# EAGLE design triac-1 (EAGLE 4.15)
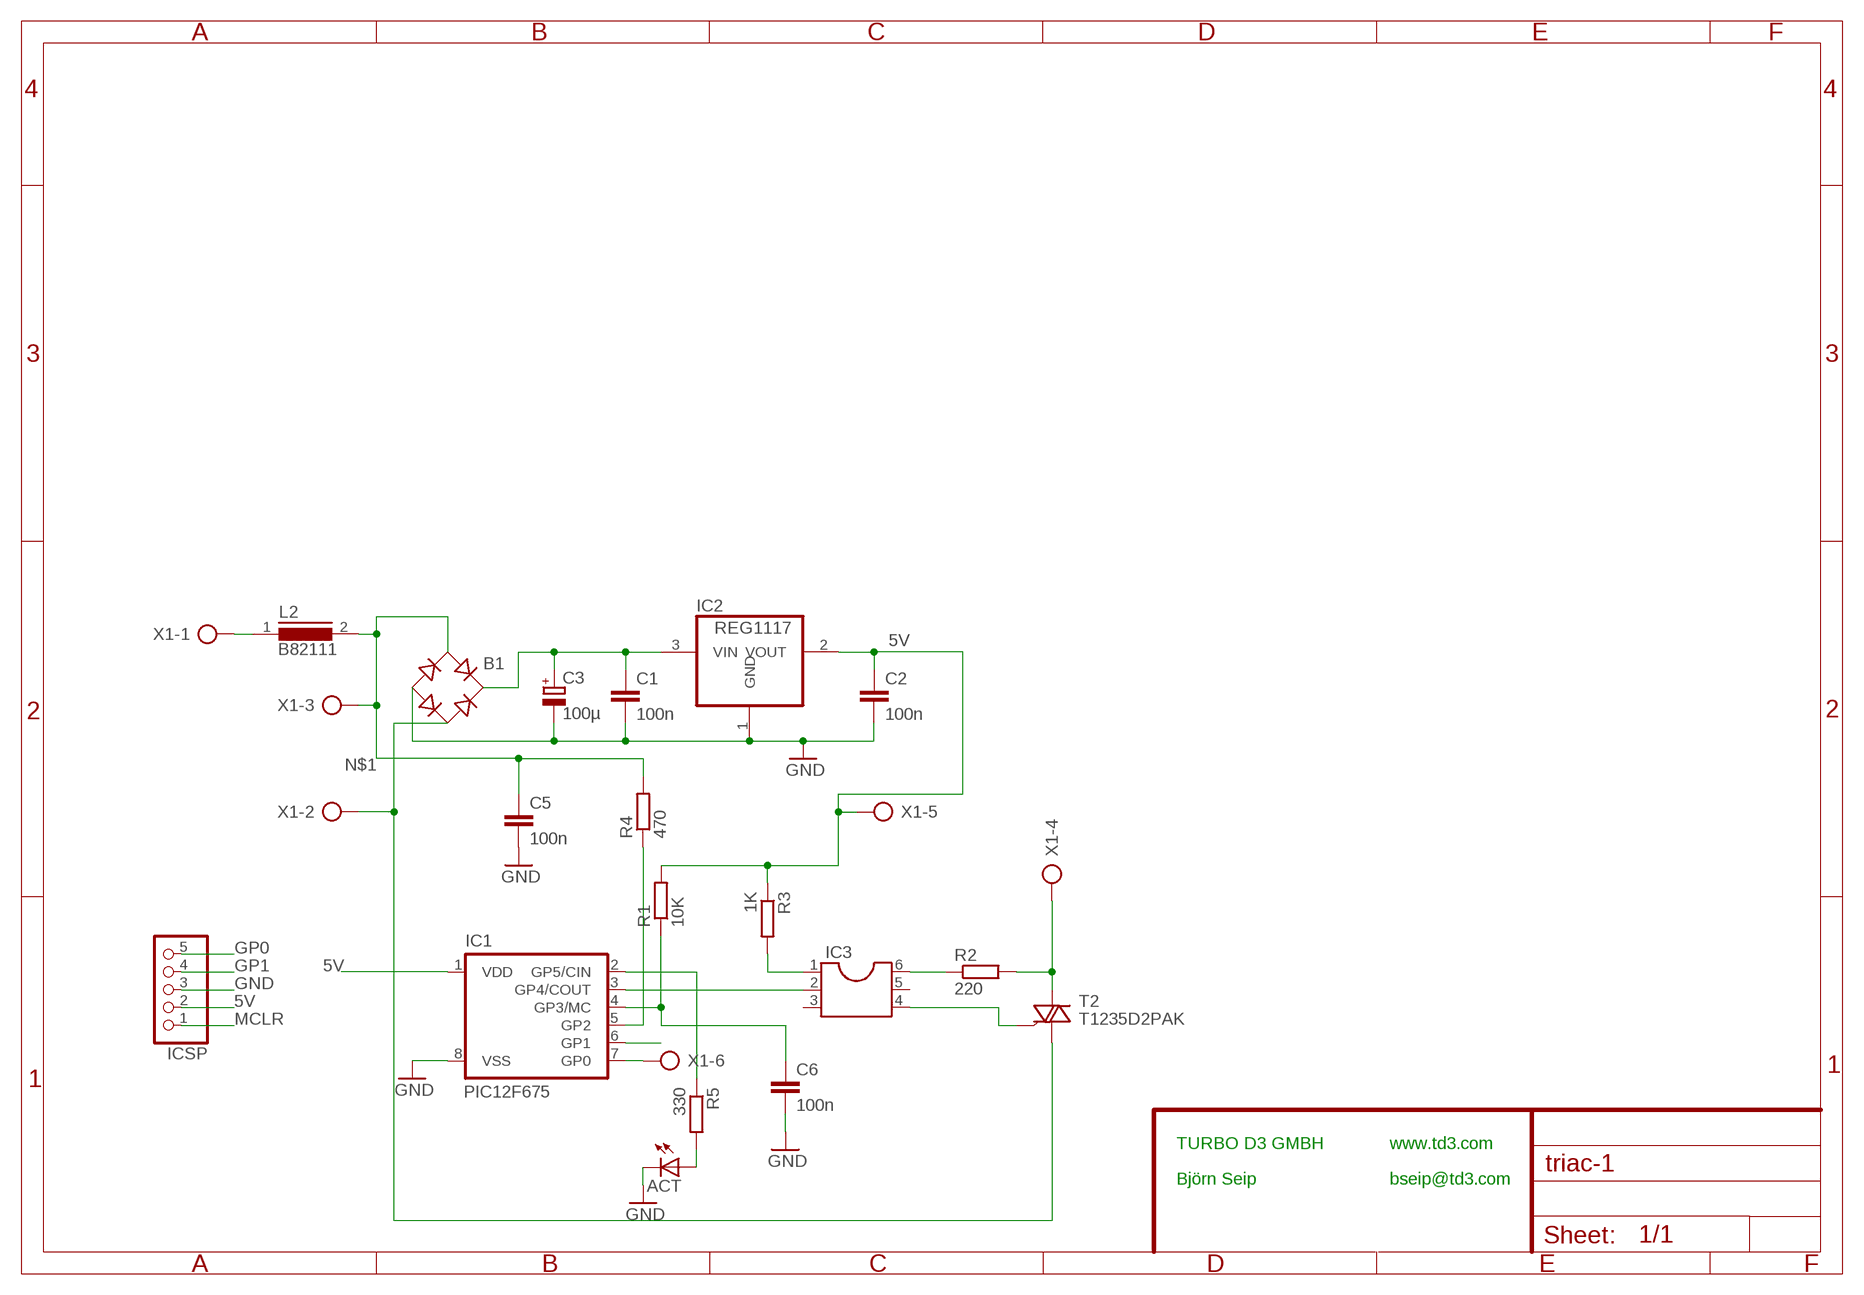
[diagram p0: schematic, sheet 1]

## Parts
ACT  LEDCHIPLED_0805  [CHIPLED_0805]
B1  RECTIFIER-B40S  [B40S]
C1  100n  C-EUC0805  [C0805]
C2  100n  C-EUC0805  [C0805]
C3  100µ  CPOL-EUE5-8.5  [E5-8,5]
C5  100n  C-EUC0805  [C0805]
C6  100n  C-EUC0805  [C0805]
IC1  PIC12F675  PIC12C508SM  [SO-08M]
IC2  REG1117  [SOT223]
IC3  DIL6  [DIL06]
ICSP  PINHD-1X5  [1X05]
L2  B82111  [SUKW1-30]
R1  10K  R-EU_R0805  [R0805]
R2  220  R-EU_R0805  [R0805]
R3  1K  R-EU_R0805  [R0805]
R4  470  R-EU_R0805  [R0805]
R5  330  R-EU_R0805  [R0805]
T2  T1235D2PAK  [D2PACK]
X1  AK500/6  [AK500/6]

## Nets
5V: C2.1 IC1.1(VDD) IC2.2(VOUT) ICSP.2 R1.2 R3.1 X1.5
GND: ACT.C B1.- C1.2 C2.2 C3.- C5.2 C6.2 IC1.8(VSS) IC2.1(GND) ICSP.3
GP0: IC1.7(GP0) ICSP.5 X1.6
GP1: IC1.6(GP1) ICSP.4
LIN: R2.2 T2.2(A2) X1.4
MCLR: C6.1 IC1.4(GP3/MC) ICSP.1 R1.1
N$1: B1.AC1 C5.1 L2.2 R4.2 X1.3
N$2: IC3.1 R3.2
N$3: B1.+ C1.1 C3.+ IC2.3(VIN)
N$4: IC1.2(GP5/CIN) R5.1
N$5 [high]: L2.1 X1.1
N$6: IC1.3(GP4/COUT) IC3.2
N$7: IC3.6 R2.1
N$9: IC3.4 T2.3(G)
N$12: B1.AC2 T2.1(A1) X1.2
N$13: ACT.A R5.2
N$14: IC1.5(GP2) R4.1
Unconnected: IC3.3 IC3.5

## Notes on the sheet
- TURBO D3 GMBH | www.td3.com
- Björn Seip | bseip@td3.com

## Library data of the parts
ACT = led:LED: LED OSRAM: - CHIPLED LG R971, LG N971, LY N971, LG Q971, LY Q971, LO R971, LY R971 LH N974, LH R974 LS Q976, LO Q976, LY Q976 LO Q996 - Hyper CHIPLED LW Q18S LB Q993, LB Q99A, LB R99A - SideLED LS A670, LO A670, LY A670, LG A670, LP A670 LB A673, LV A673, LT A673, LW A673 LH A674 LY A675 LS A676, LA A676, LO A676, LY A676, LW A676 LS A679, LY A679, LG A679 - Hyper Micro SIDELED® LS Y876, LA Y876, LO Y876, LY Y876 LT Y87S - SmartLED LW L88C, LW L88S LB L89C, LB L89S, LG L890 LS L89K, LO L89K, LY L89K LS L896, LA L896, LO L896, LY L896 - TOPLED LS T670, LO T670, LY T670, LG T670, LP T670 LSG T670, LSP T670, LSY T670, LOP T670, LYG T670 LG T671, LOG T671, LSG T671 LB T673, LV T673, LT T673, LW T673 LH T674 LS T676, LA T676, LO T676, LY T676, LB T676, LH T676, LSB T676, LW T676 LB T67C, LV T67C, LT T67C, LS T67K, LO T67K, LY T67K, LW E67C LS E67B, LA E67B, LO E67B, LY E67B, LB E67C, LV E67C, LT E67C LW T67C LS T679, LY T679, LG T679 LS T770, LO T770, LY T770, LG T770, LP T770 LB T773, LV T773, LT T773, LW T773 LH T774 LS E675, LA E675, LY E675, LS T675 LS T776, LA T776, LO T776, LY T776, LB T776 LHGB T686 LT T68C, LB T68C - Hyper Mini TOPLED® LB M676 - Mini TOPLED Santana® LG M470 LS M47K, LO M47K, LY M47K Source: http://www.osram.convergy.de/
B1 = rectifier:RECTIFIER-: Rectifier
C1 C2 C5 C6 = rcl:C-EU: CAPACITOR, European symbol
C3 = rcl:CPOL-EU: POLARIZED CAPACITOR, European symbol
IC1 = microchip:PIC12C*?: MICROCONTROLLER
IC2 = burr-brown:REG1117: 800mA and 1A Low Dropout (LDO) Positive Regulator 1.8V, 2.5V, 2.85V, 3.3V, 5V, and Adj
IC3 = ic-package:DIL6: Dual In Line
ICSP = pinhead:PINHD-1X5: PIN HEADER
L2 = inductors:B82111: INDUCTOR
R1-R5 = rcl:R-EU_: RESISTOR, European symbol
T2 = turbod3:T1235
X1 = con-ptr500:AK500/6: CONNECTOR

## Net classes
0 default: width 0.3 mm
1 high: width 4 mm

## Board
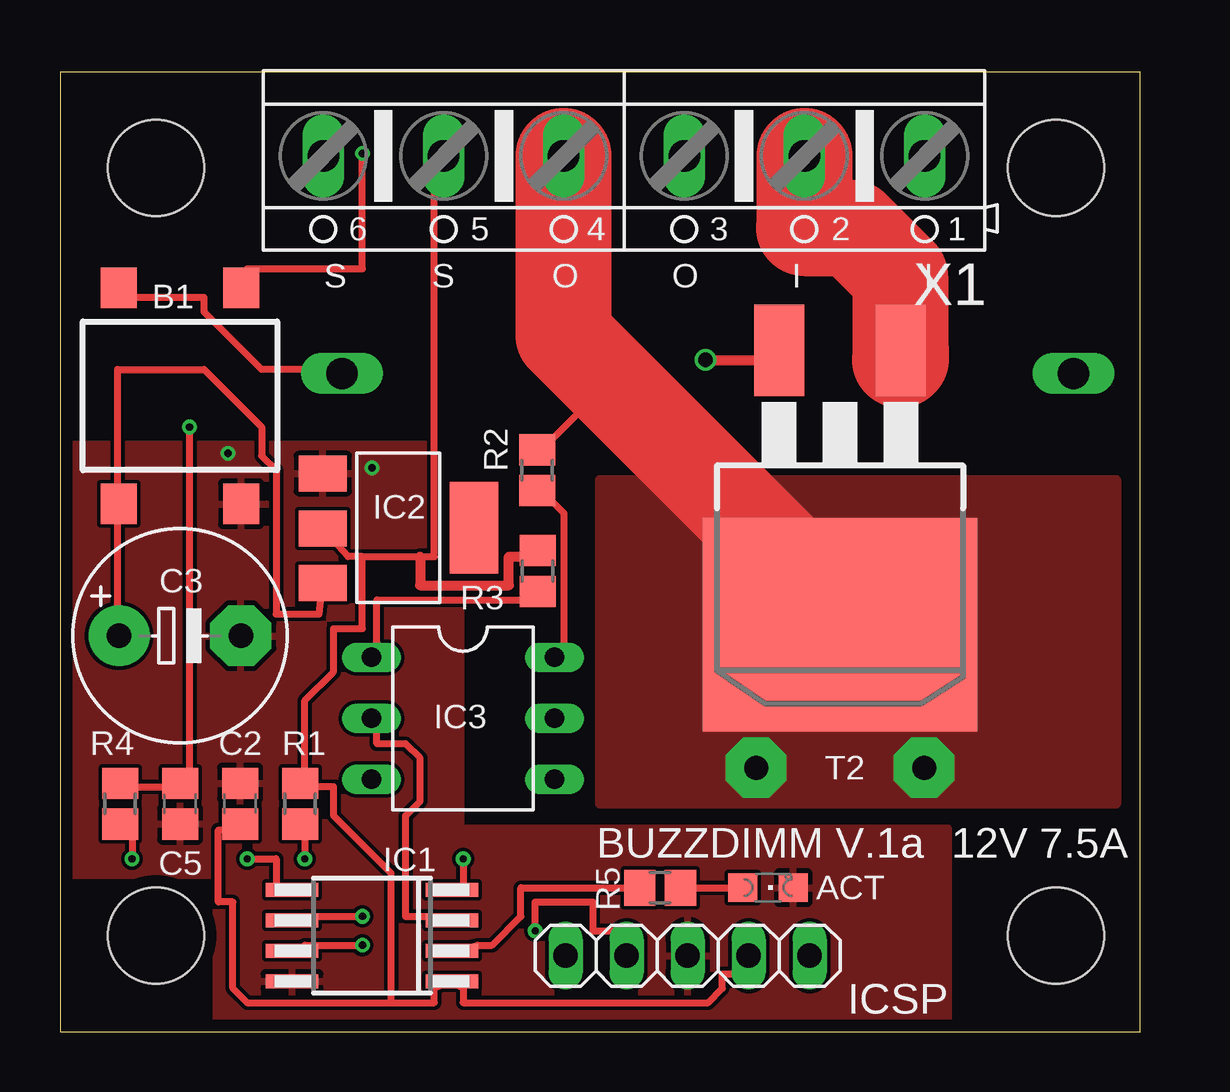
[diagram p1: board, top side]
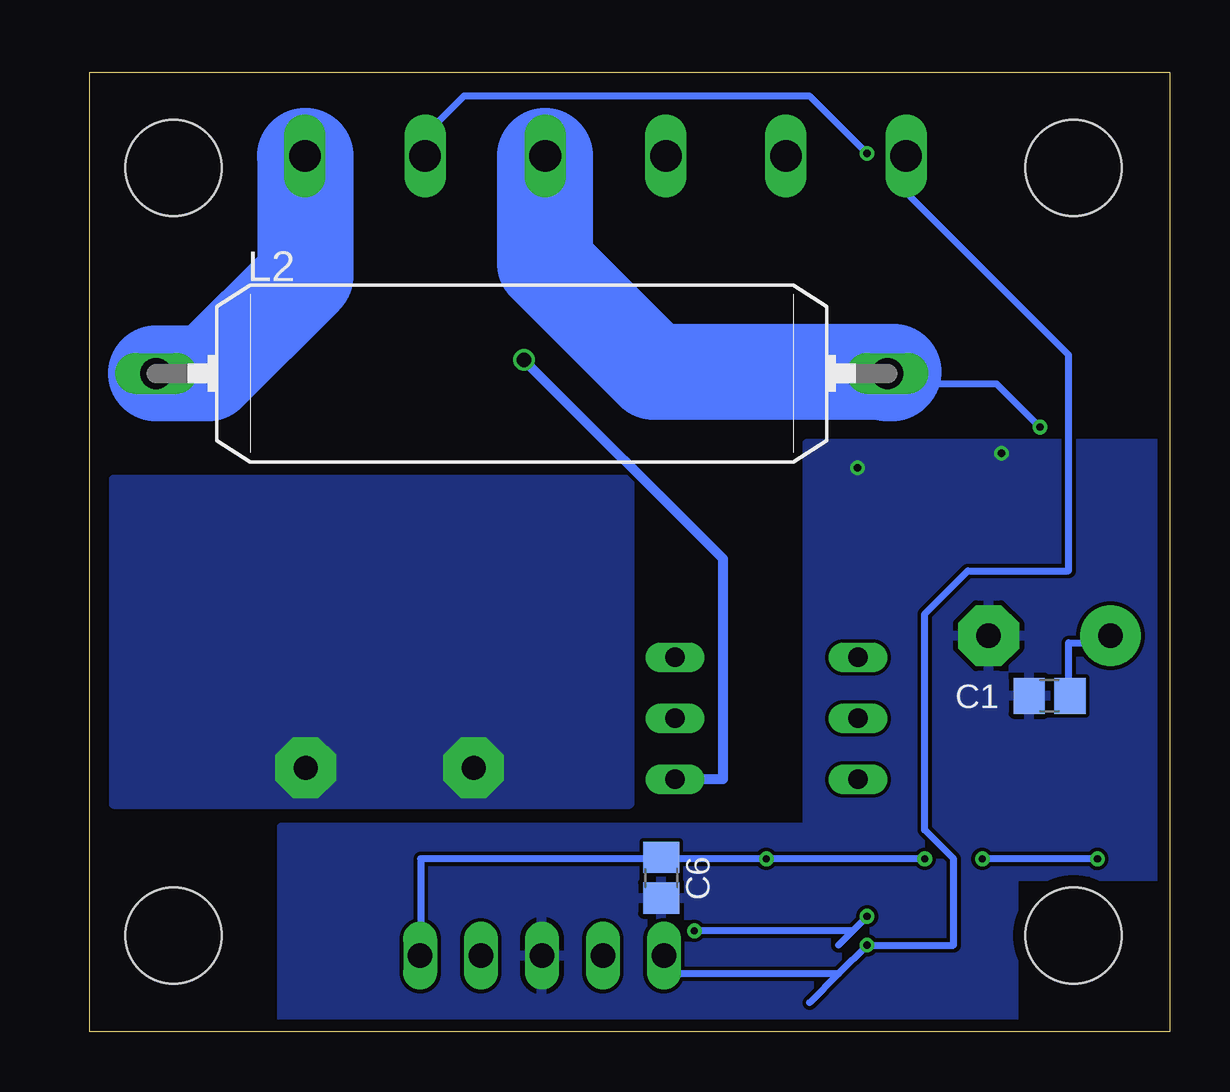
[diagram p2: board, bottom side, seen from below]

Size 45 x 40 mm. Coordinates in mm from the lower left corner, seen from the top.
Outline: 0,0 45,0 45,40 0,40 0,0
Copper layers (1*16): Top 0.035mm / dielectric 1.5mm / Bottom 0.035mm
Design rules "PCB-POOL": minimum track width 6mil, minimum drill 12mil, track to track 6mil, track to pad 6mil, pad to pad 6mil, via to via 6mil, smd to smd 6mil, copper to edge 20mil, drill to drill 8mil, minimum pad ring 8mil, minimum via ring 6mil, stop-mask expansion 3mil, vias tented up to drill 0mil, thermal gap 8mil
Holes 4 mm at 4,36 41.5,36 41.5,4 4,4

### Footprints (pad centres in the part's own frame; a part is rotated, then mirrored left to right if it is on the bottom)
CHIPLED_0805 = smd 1.2 x 1.2: A 0,-1.05; C 0,1.05
B40S = smd 1.5 x 1.7: + -2.55,-4.5; - 2.55,-4.5; AC1 -2.55,4.5; AC2 2.55,4.5
C0805 = smd 1.3 x 1.5: 1 -0.85,0; 2 0.85,0
E5-8,5 = drill 1.016 pad 2.54 round: + -2.54,0 | drill 1.016 pad 2.54 octagon: - 2.54,0
SO-08M = smd 0.6 x 2.2: 1 -1.905,-3.33; 2 -0.635,-3.33; 3 0.635,-3.33; 4 1.905,-3.33; 5 1.905,3.33; 6 0.635,3.33; 7 -0.635,3.33; 8 -1.905,3.33
SOT223 = smd 1.499 x 2.007: 1 -2.261,-3.15; 2 0.025,-3.15; 3 2.311,-3.15 | smd 3.81 x 2.007: 4 0,3.15
DIL06 = drill 0.813 long: 1 -2.54,-3.81; 2 0,-3.81; 3 2.54,-3.81; 4 2.54,3.81; 5 0,3.81; 6 -2.54,3.81
1X05 = drill 1.016 long: 1 -5.08,0; 2 -2.54,0; 3 0,0; 4 2.54,0; 5 5.08,0
SUKW1-30 = drill 1.3 long: 1 -15.24,0; 2 15.24,0
R0805 = smd 1.3 x 1.5: 1 -0.85,0; 2 0.85,0
D2PACK = smd 2.083 x 3.81: 1 -2.54,-8.89; 3 2.54,-8.89 | smd 11.43 x 8.89: 2 0,2.54
AK500/6 = drill 1.321 long: 1 -12.522,0; 2 -7.518,0; 3 -2.515,0; 4 2.515,0; 5 7.518,0; 6 12.522,0

### Placement (x,y rotation side)
ACT  29.5,6 270 top
B1  5,26.5 0 top
C1  5,14 180 bottom
C2  7.5,9.5 90 top
C3  5,16.5 0 top
C5  5,9.5 270 top
C6  21.18,6.41 270 bottom
IC1  13,4 90 top
IC2  14.1,21 270 top
IC3  16.79,13.06 270 top
ICSP  26.15,3.16 180 top
L2  26.99,27.43 0 bottom
R1  10,9.5 90 top
R2  19.88,23.4 90 top
R3  19.9,19.2 270 top
R4  2.5,9.5 90 top
R5  25,6 0 top
T2  32.5,19.5 180 top
X1  23.5,36.5 180 top

### Tracks (layer width: path | path; a pad name or v marks a point on that pad's centre or on a via)
5V
  Top 0.3: 13.8,1.2 7.8,1.2 7.2,1.8 7.2,5.4 6.6,5.4 6.6,8.4 7.2,8.4 C2.1 | 13.8,1.2 15.6,1.2 15.6,1.8 IC1.1 16.8,1.8 16.8,1.2 27,1.2 27.6,1.8 27.6,2.4 28.2,2.4 ICSP.2 | 12.6,19.8 12,19.8 IC2.2 | 12.6,19.8 15,19.8 15.6,19.8 15.6,34.8 X1.5 | 13.8,1.2 13.8,6.6 11.4,9 11.4,10.2 10.2,10.2 R1.2 10.2,10.8 10.2,13.8 11.4,15 11.4,16.8 12.6,16.8 12.6,19.8
  Top 0.406: R3.1 19.65,19.8 18.7,19.8 18.7,18.6 15,18.6 15,19.8
GND  (via drill 0.3)
  other vias: 13,23.5 7,24.1
  pour Top: 16.7,24.5 16.7,8.5 37,8.5 37,0.5 6.5,0.5 6.5,6.5 0.5,6.5 0.5,24.5
  pour Bottom: 0.5,24.5 15.1,24.5 15.1,8.5 37,8.5 37,0.5 6.5,0.5 6.5,6.5 0.5,6.5
GP0  (via drill 0.3)
  Top 0.3: v12.6,3.6 10.2,3.6 IC1.7
  Bottom 0.3: 13.8,2.4 v12.6,3.6 9,3.6 9,7.2 10.2,8.4 10.2,17.4 8.4,19.2 4.2,19.2 4.2,28.2 10.8,34.8 X1.6 | 13.8,2.4 15,1.2 | 13.8,2.4 20.4,2.4 ICSP.5
GP1  (via drill 0.3)
  Top 0.3: v12.6,4.8 10.2,4.8 IC1.6 | v19.8,4.2 19.8,5.4 22.2,5.4 22.2,4.2 23.4,4.2 ICSP.4
  Bottom 0.3: v12.6,4.8 13.2,4.2 | 13.2,4.2 13.8,3.6 | 13.2,4.2 v19.8,4.2
LIN  (via drill 1 pad 2.54)
  Top 0.3: R2.2 20.4,24.6 22.9,27.1
  Top 4: T2.2 32.96,16.96 33,17 22.9,27.1 20.98,29.02 X1.4
  other vias: 29,11 36,11
  pour Top (no thermals): 22.5,23 44,23 44,9.5 22.5,9.5
  pour Bottom (no thermals): 22.5,23 44,23 44,9.5 22.5,9.5
MCLR  (via drill 0.3)
  Top 0.3: v10.2,7.2 10.2,8.4 R1.1 | v16.8,7.2 16.8,6 IC1.4
  Bottom 0.3: 21.2,7.2 v16.8,7.2 v10.2,7.2 | 21.2,7.2 21.2,7.24 C6.1 | 21.2,7.2 31.2,7.2 31.2,4.2 ICSP.1
N$1  (via drill 0.3)
  Top 0.3: R4.2 3,10.2 4.8,10.2 C5.1 5.4,10.8 v5.4,25.2 | B1.AC1 3,30.6 6,30.6 6,30 8.4,27.6 10.8,27.6 L2.2
  Bottom 0.3: v5.4,25.2 7.2,27 9.6,27 11.57,27.43
  Bottom 4: X1.3 26.02,32.02 21.5,27.5 11.5,27.5 11.57,27.43 L2.2
N$2
  Top 0.3: R3.2 19.2,18 13.2,18 13.2,16.2 IC3.1
N$3
  Top 0.3: C3.+ 2.4,17.4 2.4,21.6 B1.+ 2.4,22.8 2.4,27.6 6,27.6 8.4,25.2 8.4,24 9,23.4 9,17.4 10.8,17.4 IC2.3
  Bottom 0.3: C1.1 4.2,14.4 4.2,16.2 3.6,16.2 C3.+
N$4
  Top 0.3: R5.1 19.2,6 19.2,4.8 18,3.6 17.4,3.6 IC1.2
N$5
  Bottom 4: L2.1 40.07,27.43 36,31.5 36,36.5 X1.1
N$6
  Top 0.3: IC1.3 15.6,4.8 14.4,4.8 14.4,9 15,9.6 15,11.4 14.4,12 13.2,12 13.2,12.6 IC3.2
N$7
  Top 0.3: R2.1 20.4,22.2 21,21.6 21,16.2 IC3.6
N$9  (via drill 0.6)
  Top 0.3: T2.3 29.4,30
  Top 0.406: T2.3 29.96,28.14 30,28.1 29.9,28 v26.9,28
  Bottom 0.406: IC3.4 18.6,10.52 18.6,19.7 v26.9,28
N$12  (via drill 0.3)
  Top 0.3: v12.6,36.6 12.6,31.8 7.8,31.8 B1.AC2
  Top 4: X1.2 31.02,33.52 31,33.5 33,33.5 35,31.5 35,28 35.04,28.04 T2.1
  Bottom 0.3: v12.6,36.6 15,39 29.4,39 30.6,37.8 X1.2
N$13
  Top 0.3: R5.2 ACT.A
N$14  (via drill 0.3)
  Top 0.3: v3,7.2 3,8.4 R4.1 | v7.8,7.2 9,7.2 9,6 IC1.5
  Bottom 0.3: v3,7.2 v7.8,7.2

### Text on the board
tPlace: S | S | O | O | I | I | BUZZDIMM V.1a | 12V 7.5A